# Altium schematic sheet PowCarbinBoard_Connect.SchDoc
size A3
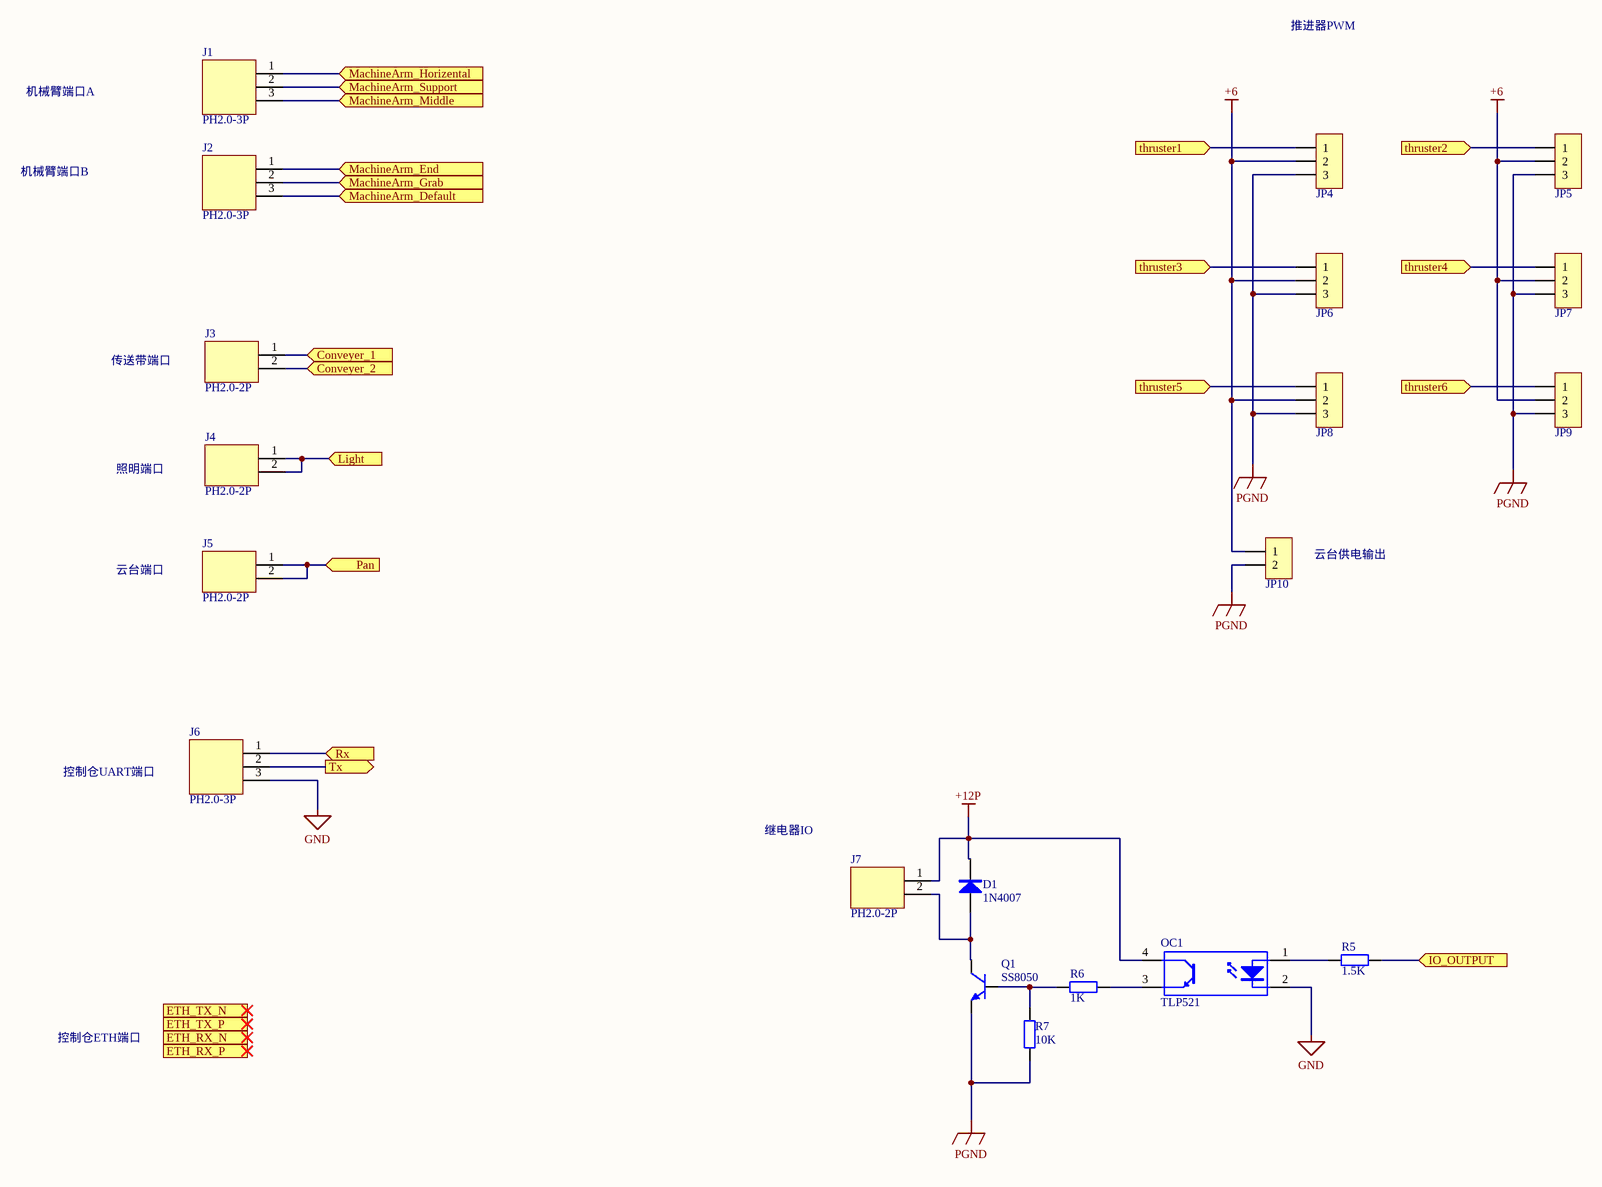
[diagram p0: PowCarbinBoard_Connect.SchDoc]

## Parts
D1  1N4007  [SOD-123]
J1  PH2.0-3P  [PH2.0-3P]
J2  PH2.0-3P  [PH2.0-3P]
J3  PH2.0-2P  [PH2.0-2P]
J4  PH2.0-2P  [PH2.0-2P]
J5  PH2.0-2P  [PH2.0-2P]
J6  PH2.0-3P  [PH2.0-3P]
J7  PH2.0-2P  [PH2.0-2P]
JP4  HDR-1X3  [HDR2.54-LI-3P]  (value not drawn)
JP5  HDR-1X3  [HDR2.54-LI-3P]  (value not drawn)
JP6  HDR-1X3  [HDR2.54-LI-3P]  (value not drawn)
JP7  HDR-1X3  [HDR2.54-LI-3P]  (value not drawn)
JP8  HDR-1X3  [HDR2.54-LI-3P]  (value not drawn)
JP9  HDR-1X3  [HDR2.54-LI-3P]  (value not drawn)
JP10  HDR-1X2  [KF128-5.08-2P]  (value not drawn)
OC1  TLP521  [DIP_TLP521]
Q1  SS8050  [SOT23-3N]
R5  1.5K  [0603_R]
R6  1K  [0603_R]
R7  10K  [0603_R]

## Ports
Conveyer_1 (in), Conveyer_2 (in), ETH_RX_N (in), ETH_RX_P (in), ETH_TX_N (in), ETH_TX_P (in), IO_OUTPUT (in), Light (in), MachineArm_Default (in), MachineArm_End (in), MachineArm_Grab (in), MachineArm_Horizental (in), MachineArm_Middle (in), MachineArm_Support (in), Pan (in), Rx (in), thruster1 (in), thruster2 (in), thruster3 (in), thruster4 (in), thruster5 (in), thruster6 (in), Tx (out)

## Nets
+6: JP4.2 JP5.2 JP6.2 JP7.2 JP8.2 JP9.2 JP10.1
+12P: D1.2(K) J7.1 OC1.4(C)
GND: J6.3 OC1.2(K)
PGND: JP4.3 JP5.3 JP6.3 JP7.3 JP8.3 JP9.3 JP10.2 Q1.2(E) R7.1
Conveyer_1: J3.1 ; port Conveyer_1
Conveyer_2: J3.2 ; port Conveyer_2
IO_OUTPUT: R5.2 ; port IO_OUTPUT
Light: J4.1 J4.2 ; port Light
MachineArm_Default: J2.3 ; port MachineArm_Default
MachineArm_End: J2.1 ; port MachineArm_End
MachineArm_Grab: J2.2 ; port MachineArm_Grab
MachineArm_Horizental: J1.1 ; port MachineArm_Horizental
MachineArm_Middle: J1.3 ; port MachineArm_Middle
MachineArm_Support: J1.2 ; port MachineArm_Support
Pan: J5.1 J5.2 ; port Pan
Rx: J6.1 ; port Rx
thruster1: JP4.1 ; port thruster1
thruster2: JP5.1 ; port thruster2
thruster3: JP6.1 ; port thruster3
thruster4: JP7.1 ; port thruster4
thruster5: JP8.1 ; port thruster5
thruster6: JP9.1 ; port thruster6
Tx: J6.2 ; port Tx
NetD1_1: D1.1(A) J7.2 Q1.3(C)
NetOC1_1: OC1.1(A) R5.1
NetOC1_3: OC1.3(E) R6.1
NetQ1_1: Q1.1(B) R6.2 R7.2

## Notes on the sheet
- 推进器PWM
- 机械臂端口A
- 机械臂端口B
- 传送带端口
- 照明端口
- 云台端口
- (near JP10) 云台供电输出
- 控制仓UART端口
- 继电器IO
- 控制仓ETH端口

## Library data of the parts
D1 = 1N4007: 整流二极管; 版权归属: 源创客; BOM名称: 整流二极管; 学习资源: www.ooocke.com
JP4-JP9 = Header 3: 3P接插件; 版权归属: 源创客; BOM名称: 3P接插件; 学习资源: www.ooocke.com
JP10 = Header 2: 2P接插件; 版权归属: 源创客; BOM名称: 2P接插件; 学习资源: www.ooocke.com
OC1 = TLP521: 开关光耦
Q1 = 8050-SMD: 高频放大-NPN型; 版权归属: 源创客; 属性: 40V 1.5A 1W 100MHZ; BOM名称: 高频放大-NPN型; 学习资源: www.ooocke.com
R5-R7 = 0603 10KΩ (1002) 1%: 贴片电阻; ComponentLink1Description: 供应商链接; ComponentLink1URL: http://www.szlcsc.com/product/details_26547.html; Package: 0603; Supplier: LC; SuppliersPartNumber: C25804